# Altium schematic sheet REGENIX_Relais_24V_3.SchDoc
size Tabloid; Date: Date; Author: Author 1; DocumentNumber: 2; Revision: 1; SheetNumber: 16; SheetTotal: 17; Size: 11x17; Sheet_Name: BATTERY PROTECTION & AUXILIARY
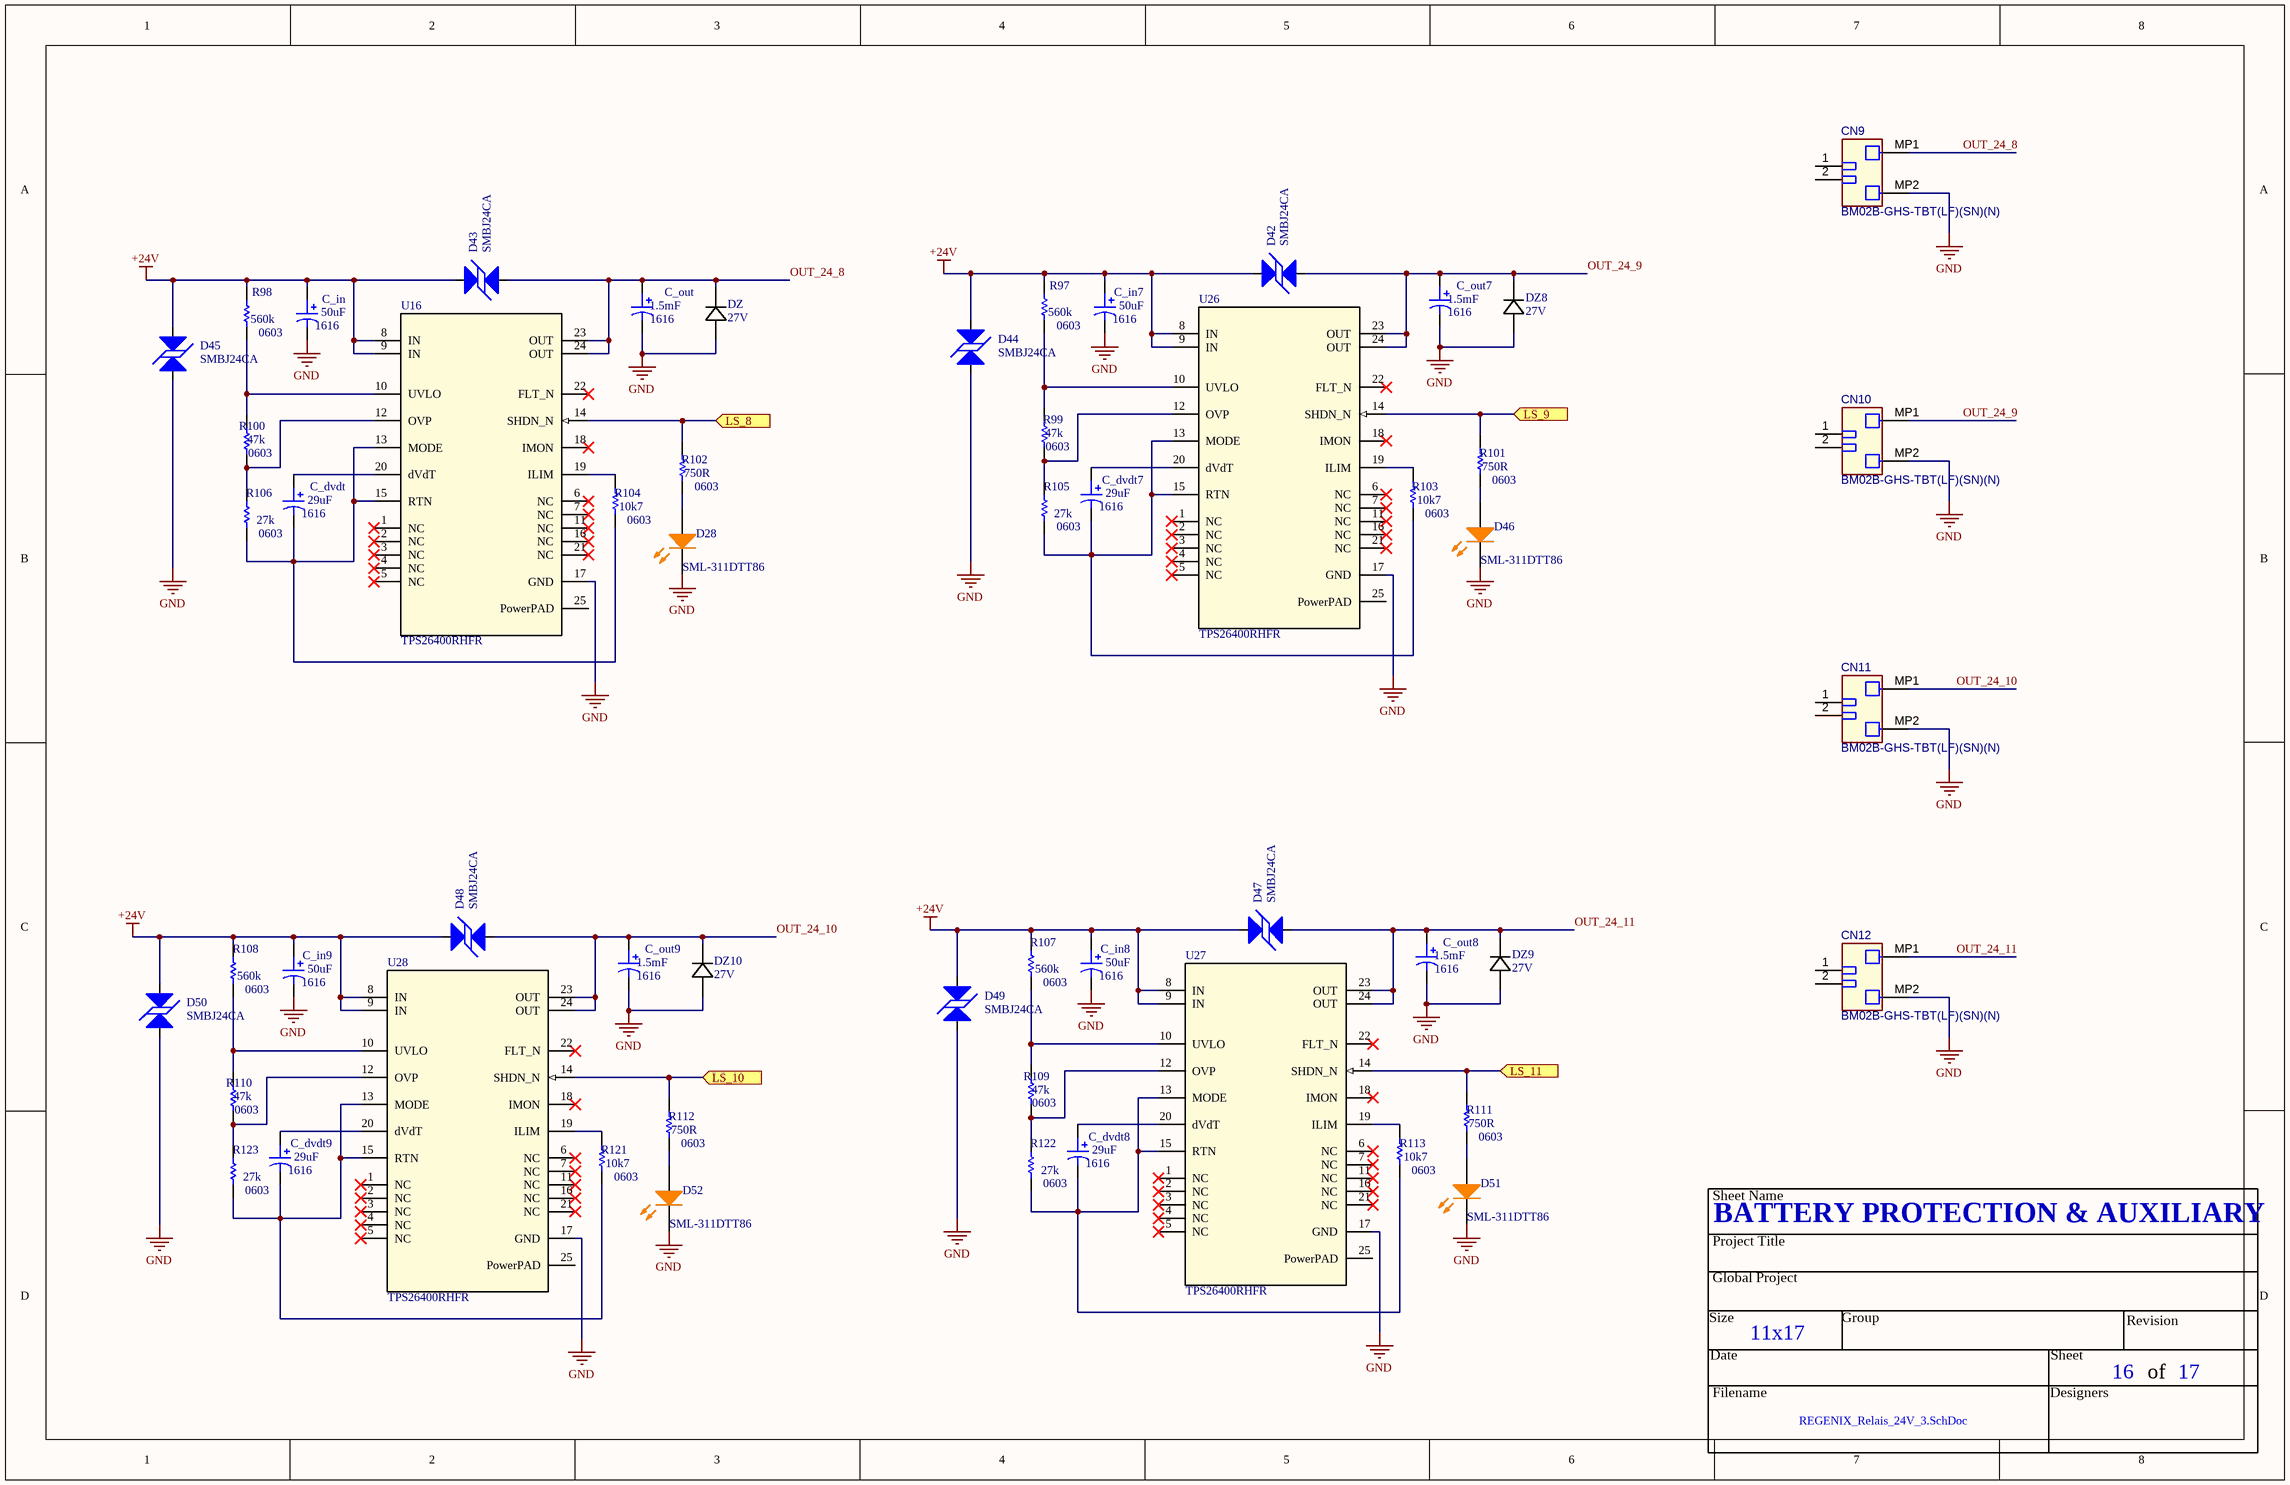
[diagram p0: REGENIX_Relais_24V_3.SchDoc]

## Parts
C_dvdt  value 29uF  Package: 1616  [CAP_ALU_1616_vishay]  (hidden comment: MAL214699108E3)
C_dvdt7  value 29uF  Package: 1616  [CAP_ALU_1616_vishay]  (hidden comment: MAL214699108E3)
C_dvdt8  value 29uF  Package: 1616  [CAP_ALU_1616_vishay]  (hidden comment: MAL214699108E3)
C_dvdt9  value 29uF  Package: 1616  [CAP_ALU_1616_vishay]  (hidden comment: MAL214699108E3)
C_in  value 50uF  Package: 1616  [CAP_ALU_1616_vishay]  (hidden comment: MAL214699108E3)
C_in7  value 50uF  Package: 1616  [CAP_ALU_1616_vishay]  (hidden comment: MAL214699108E3)
C_in8  value 50uF  Package: 1616  [CAP_ALU_1616_vishay]  (hidden comment: MAL214699108E3)
C_in9  value 50uF  Package: 1616  [CAP_ALU_1616_vishay]  (hidden comment: MAL214699108E3)
C_out  value 1.5mF  Package: 1616  [CAP_ALU_1616_vishay]  (hidden comment: MAL214699108E3)
C_out7  value 1.5mF  Package: 1616  [CAP_ALU_1616_vishay]  (hidden comment: MAL214699108E3)
C_out8  value 1.5mF  Package: 1616  [CAP_ALU_1616_vishay]  (hidden comment: MAL214699108E3)
C_out9  value 1.5mF  Package: 1616  [CAP_ALU_1616_vishay]  (hidden comment: MAL214699108E3)
CN9  BM02B-GHS-TBT(LF)(SN)(N)  [JST-BM02B-GHS-TBT_V]
CN10  BM02B-GHS-TBT(LF)(SN)(N)  [JST-BM02B-GHS-TBT_V]
CN11  BM02B-GHS-TBT(LF)(SN)(N)  [JST-BM02B-GHS-TBT_V]
CN12  BM02B-GHS-TBT(LF)(SN)(N)  [JST-BM02B-GHS-TBT_V]
D28  SML-311DTT86  [LED_0603]
D42  SMBJ24CA  [TVS_PWR_SMBJ36CA]
D43  SMBJ24CA  [TVS_PWR_SMBJ36CA]
D44  SMBJ24CA  [TVS_PWR_SMBJ36CA]
D45  SMBJ24CA  [TVS_PWR_SMBJ36CA]
D46  SML-311DTT86  [LED_0603]
D47  SMBJ24CA  [TVS_PWR_SMBJ36CA]
D48  SMBJ24CA  [TVS_PWR_SMBJ36CA]
D49  SMBJ24CA  [TVS_PWR_SMBJ36CA]
D50  SMBJ24CA  [TVS_PWR_SMBJ36CA]
D51  SML-311DTT86  [LED_0603]
D52  SML-311DTT86  [LED_0603]
DZ  27V  [SOD123_DIO]
DZ8  27V  [SOD123_DIO]
DZ9  27V  [SOD123_DIO]
DZ10  27V  [SOD123_DIO]
R97  Package: 0603  Precision: 560k  [RES_0603]  (hidden comment: RES - 0603)
R98  Package: 0603  Precision: 560k  [RES_0603]  (hidden comment: RES - 0603)
R99  Package: 0603  Precision: 47k  [RES_0603]  (hidden comment: RES - 0603)
R100  Package: 0603  Precision: 47k  [RES_0603]  (hidden comment: RES - 0603)
R101  Package: 0603  Precision: 750R  [RES_0603]  (hidden comment: RES - 0603)
R102  Package: 0603  Precision: 750R  [RES_0603]  (hidden comment: RES - 0603)
R103  Package: 0603  Precision: 10k7  [RES_0603]  (hidden comment: RES - 0603)
R104  Package: 0603  Precision: 10k7  [RES_0603]  (hidden comment: RES - 0603)
R105  Package: 0603  Precision: 27k  [RES_0603]  (hidden comment: RES - 0603)
R106  Package: 0603  Precision: 27k  [RES_0603]  (hidden comment: RES - 0603)
R107  Package: 0603  Precision: 560k  [RES_0603]  (hidden comment: RES - 0603)
R108  Package: 0603  Precision: 560k  [RES_0603]  (hidden comment: RES - 0603)
R109  Package: 0603  Precision: 47k  [RES_0603]  (hidden comment: RES - 0603)
R110  Package: 0603  Precision: 47k  [RES_0603]  (hidden comment: RES - 0603)
R111  Package: 0603  Precision: 750R  [RES_0603]  (hidden comment: RES - 0603)
R112  Package: 0603  Precision: 750R  [RES_0603]  (hidden comment: RES - 0603)
R113  Package: 0603  Precision: 10k7  [RES_0603]  (hidden comment: RES - 0603)
R121  Package: 0603  Precision: 10k7  [RES_0603]  (hidden comment: RES - 0603)
R122  Package: 0603  Precision: 27k  [RES_0603]  (hidden comment: RES - 0603)
R123  Package: 0603  Precision: 27k  [RES_0603]  (hidden comment: RES - 0603)
U16  TPS26400RHFR  [RHF0024A-IPC_A]
U26  TPS26400RHFR  [RHF0024A-IPC_A]
U27  TPS26400RHFR  [RHF0024A-IPC_A]
U28  TPS26400RHFR  [RHF0024A-IPC_A]

## Ports
LS_8 (in), LS_9 (in), LS_10 (in), LS_11 (in)

## Nets
+24V: C_in.1 C_in7.1 C_in8.1 C_in9.1 D42.1 D43.1 D44.1 D45.1 D47.1 D48.1 D49.1 D50.1 R97.2 R98.2 R107.2 R108.2 U16.8(IN) U16.9(IN) U26.8(IN) U26.9(IN) U27.8(IN) U27.9(IN) U28.8(IN) U28.9(IN)
GND: C_in.2 C_in7.2 C_in8.2 C_in9.2 C_out.2 C_out7.2 C_out8.2 C_out9.2 CN9.MP2 CN10.MP2 CN11.MP2 CN12.MP2 D28.K D44.2 D45.2 D46.K D49.2 D50.2 D51.K D52.K DZ.2 DZ8.2 DZ9.2 DZ10.2 U16.17(GND) U26.17(GND) U27.17(GND) U28.17(GND)
LS_8: R102.2 U16.14(SHDN_N) ; port LS_8
LS_9: R101.2 U26.14(SHDN_N) ; port LS_9
LS_10: R112.2 U28.14(SHDN_N) ; port LS_10
LS_11: R111.2 U27.14(SHDN_N) ; port LS_11
OUT_24_8: C_out.1 CN9.MP1 D43.2 DZ.1 U16.23(OUT) U16.24(OUT)
OUT_24_9: C_out7.1 CN10.MP1 D42.2 DZ8.1 U26.23(OUT) U26.24(OUT)
OUT_24_10: C_out9.1 CN11.MP1 D48.2 DZ10.1 U28.23(OUT) U28.24(OUT)
OUT_24_11: C_out8.1 CN12.MP1 D47.2 DZ9.1 U27.23(OUT) U27.24(OUT)
NetC_dvdt7_1: C_dvdt7.1 U26.20(dVdT)
NetC_dvdt7_2: C_dvdt7.2 R103.1 R105.1 U26.13(MODE) U26.15(RTN)
NetC_dvdt8_1: C_dvdt8.1 U27.20(dVdT)
NetC_dvdt8_2: C_dvdt8.2 R113.1 R122.1 U27.13(MODE) U27.15(RTN)
NetC_dvdt9_1: C_dvdt9.1 U28.20(dVdT)
NetC_dvdt9_2: C_dvdt9.2 R121.1 R123.1 U28.13(MODE) U28.15(RTN)
NetC_dvdt_1: C_dvdt.1 U16.20(dVdT)
NetC_dvdt_2: C_dvdt.2 R104.1 R106.1 U16.13(MODE) U16.15(RTN)
NetD28_A: D28.A R102.1
NetD46_A: D46.A R101.1
NetD51_A: D51.A R111.1
NetD52_A: D52.A R112.1
NetR97_1: R97.1 R99.2 U26.10(UVLO)
NetR98_1: R98.1 R100.2 U16.10(UVLO)
NetR99_1: R99.1 R105.2 U26.12(OVP)
NetR100_1: R100.1 R106.2 U16.12(OVP)
NetR103_2: R103.2 U26.19(ILIM)
NetR104_2: R104.2 U16.19(ILIM)
NetR107_1: R107.1 R109.2 U27.10(UVLO)
NetR108_1: R108.1 R110.2 U28.10(UVLO)
NetR109_1: R109.1 R122.2 U27.12(OVP)
NetR110_1: R110.1 R123.2 U28.12(OVP)
NetR113_2: R113.2 U27.19(ILIM)
NetR121_2: R121.2 U28.19(ILIM)

Not connected (* = marked no-connect by the designer): CN9 1 2; CN10 1 2; CN11 1 2; CN12 1 2; U16 1(NC)* 2(NC)* 3(NC)* 4(NC)* 5(NC)* 6(NC)* 7(NC)* 11(NC)* 16(NC)* 18(IMON)* 21(NC)* 22(FLT_N)* 25(PowerPAD); U26 1(NC)* 2(NC)* 3(NC)* 4(NC)* 5(NC)* 6(NC)* 7(NC)* 11(NC)* 16(NC)* 18(IMON)* 21(NC)* 22(FLT_N)* 25(PowerPAD); U27 1(NC)* 2(NC)* 3(NC)* 4(NC)* 5(NC)* 6(NC)* 7(NC)* 11(NC)* 16(NC)* 18(IMON)* 21(NC)* 22(FLT_N)* 25(PowerPAD); U28 1(NC)* 2(NC)* 3(NC)* 4(NC)* 5(NC)* 6(NC)* 7(NC)* 11(NC)* 16(NC)* 18(IMON)* 21(NC)* 22(FLT_N)* 25(PowerPAD)

## Notes on the sheet
- Sheet Name
- Project Title
- Global Project
- Revision
- Size
- Date
- Group
- Sheet
- of
- Filename
- Designers

## Library data of the parts
C_dvdt C_dvdt7-C_dvdt9 C_in C_in7-C_in9 C_out C_out7-C_out9 = CAP_ALU_MAL214699108E3: CAP - ALU 470uF 20% 50V - 1616; Current: 1.3A; Mfg: Vishay Dale; Mfg Part Number: MAL214699108E3; HelpURL: http://www.vishay.com/docs/28403/146cti.pdf; CreatedBy: Jonathan Bouchard; Temperature: -55°C to 125°C; Power: *; Supplier 1: Digikey; Supplier Part Number 1: 4442PHCT-ND
CN9-CN12 = CMP-002-00061-3: Disconnectable Crimp Style Connector, Pitch 1.25 mm, 1 x 2 Position, Height 4.05 mm, -25 to 85 degC, RoHS, Tape and Reel; Connector Type: Header,Shrouded; Mounting Technology: SurfaceMount; Case/Package: Disconnectable Crimp Style Connector, Pitch 1.25 mm, 1 x 2 Position, Height 4.05 mm; Pins: 4
D28 D46 D51 D52 = LED_SML-311DTT86: LED - 611nM ORANGE 2mA - 0603; Voltage: 1.8V; Mfg: ROHM Semiconductor; Power: 44mW; Current: 2mA; HelpURL: http://media.digikey.com/pdf/Data%20Sheets/Rohm%20PDFs/SML-311%20Series.pdf; CreatedBy: Jonathan Bouchard; Temperature: -40°C to 85°C; Package: 0603; Precision: *; Mfg Part Number: SML-311DTT86; Supplier 1: Digikey; Supplier Part Number 1: 511-1303-1-ND
D42-D45 D47-D50 = TVS_PWR_SMBJ24CA: TVS - 24V 26.7V 600W - DO214AA; Manufacturer #1: Littelfuse Inc.; Value: Vbr = 26.7V -  Clamp = 38.9V; Voltage Rating: 24V Standoff; Current Rating: 15.5A; GRAMS Lib Spec: 2.8; Magnetic Material: UNKNOWN; Polarized: NO; Tolerance: *; Power Max: 600W; HelpURL: http://www.littelfuse.com/~/media/electronics/datasheets/tvs_diodes/littelfuse_tvs_diode_smbj_datasheet.pdf.pdf; CreatedBy/Date: Arnaud Samson - 06/07/18; VerifiedBy: Jonathan Bouchard - 2018-07-13; Temperature: -65°C ~ 150°C (TJ); Package: DO214AA; Manufacturer #2: *; Note: *; Assembly Type: SMD; Part Number #2: *; Part Number #1: SMBJ24CA; Supplier 1: Digi-Key; Supplier Part Number 1: SMBJ24CALFCT-ND; Cryo: UNKNOWN
DZ DZ8-DZ10 = MMSZ5254B-7-F: DIODE ZENER 27V 500MW SOD123 MMSZ5254B-7-F; Mfr_Name: Diodes Inc
U16 U26-U28 = TPS26400RHFR: No Description Available; Mfr_Name: Texas Instruments; TYPE: TYPE; RefDes: RefDes
R97-R113 R121-R123 = RES - 0603: Current: *; CreatedBy: Jonathan Bouchard